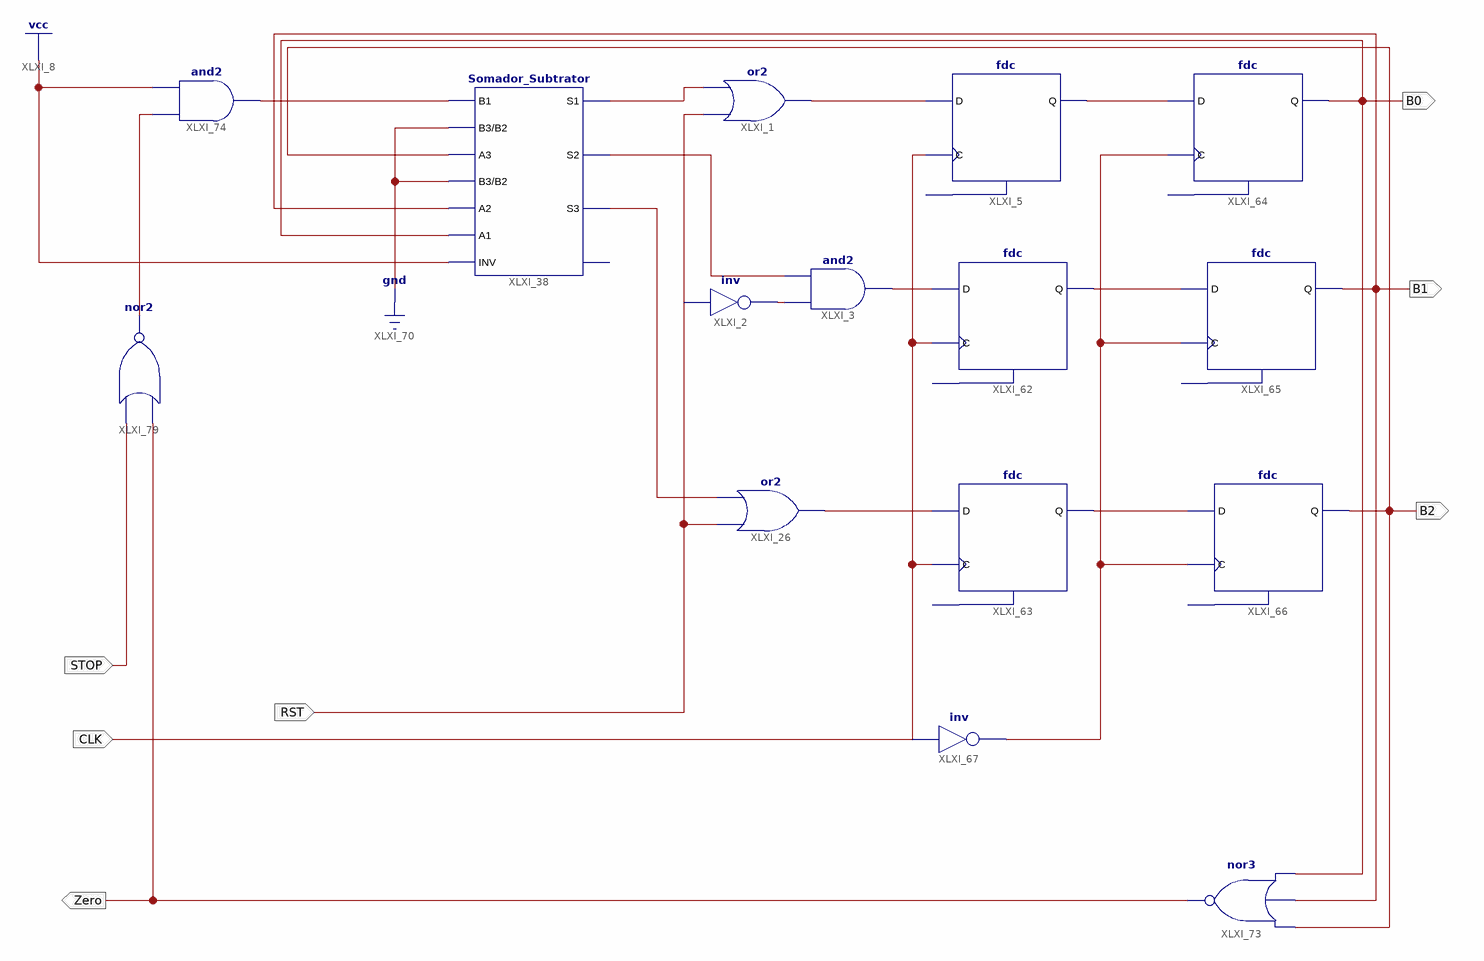
[diagram p0: schematic sheet 1]
// Xilinx ISE schematic Rel.sch (spartan3) as structural Verilog: 15 symbols, 7 ports
module Rel (
  input  RST,
  input  CLK,
  input  STOP,
  output B0,
  output B2,
  output Zero,
  output B1
);

  wire XLXN_2, XLXN_3, XLXN_4, XLXN_5, XLXN_11, XLXN_12, XLXN_13, XLXN_94, XLXN_95, XLXN_96, XLXN_99,
       XLXN_104, XLXN_116;

  or XLXI_1 (XLXN_2, RST, XLXN_11);
  not XLXI_2 (XLXN_5, RST);
  and XLXI_3 (XLXN_4, XLXN_5, XLXN_12);
  or XLXI_26 (XLXN_3, RST, XLXN_13);
  fdc #(.INIT("1")) XLXI_5 (.C(CLK), .D(XLXN_2), .Q(XLXN_94));  // open: CLR
  fdc #(.INIT("1")) XLXI_63 (.C(CLK), .D(XLXN_3), .Q(XLXN_95));  // open: CLR
  fdc XLXI_64 (.C(XLXN_99), .D(XLXN_94), .Q(B0));  // open: CLR
  fdc XLXI_65 (.C(XLXN_99), .D(XLXN_96), .Q(B1));  // open: CLR
  fdc XLXI_66 (.C(XLXN_99), .D(XLXN_95), .Q(B2));  // open: CLR
  not XLXI_67 (XLXN_99, CLK);
  Somador_Subtrator XLXI_38 (
    .B1(XLXN_116), .B3(1'b0), .A3(B2), .B2(1'b0), .A2(B1), .A1(B0), .INV(1'b1), .S1(XLXN_11), .S2(XLXN_12),
    .S3(XLXN_13));  // open: S4
  nor XLXI_73 (Zero, B0, B1, B2);
  and XLXI_74 (XLXN_116, XLXN_104, 1'b1);
  nor XLXI_79 (XLXN_104, Zero, STOP);
  fdc XLXI_62 (.C(CLK), .D(XLXN_4), .Q(XLXN_96));  // open: CLR
endmodule
